# Altium schematic sheet Sheet1.SchDoc: ARDUINO BASED DEVELOPMENT BOARD
size A4; Author: PRATEEK PANDEY; DrawnBy: PRATEEK PANDEY; Engineer: PRATEEK PANDEY; SheetNumber: 1; SheetTotal: 2
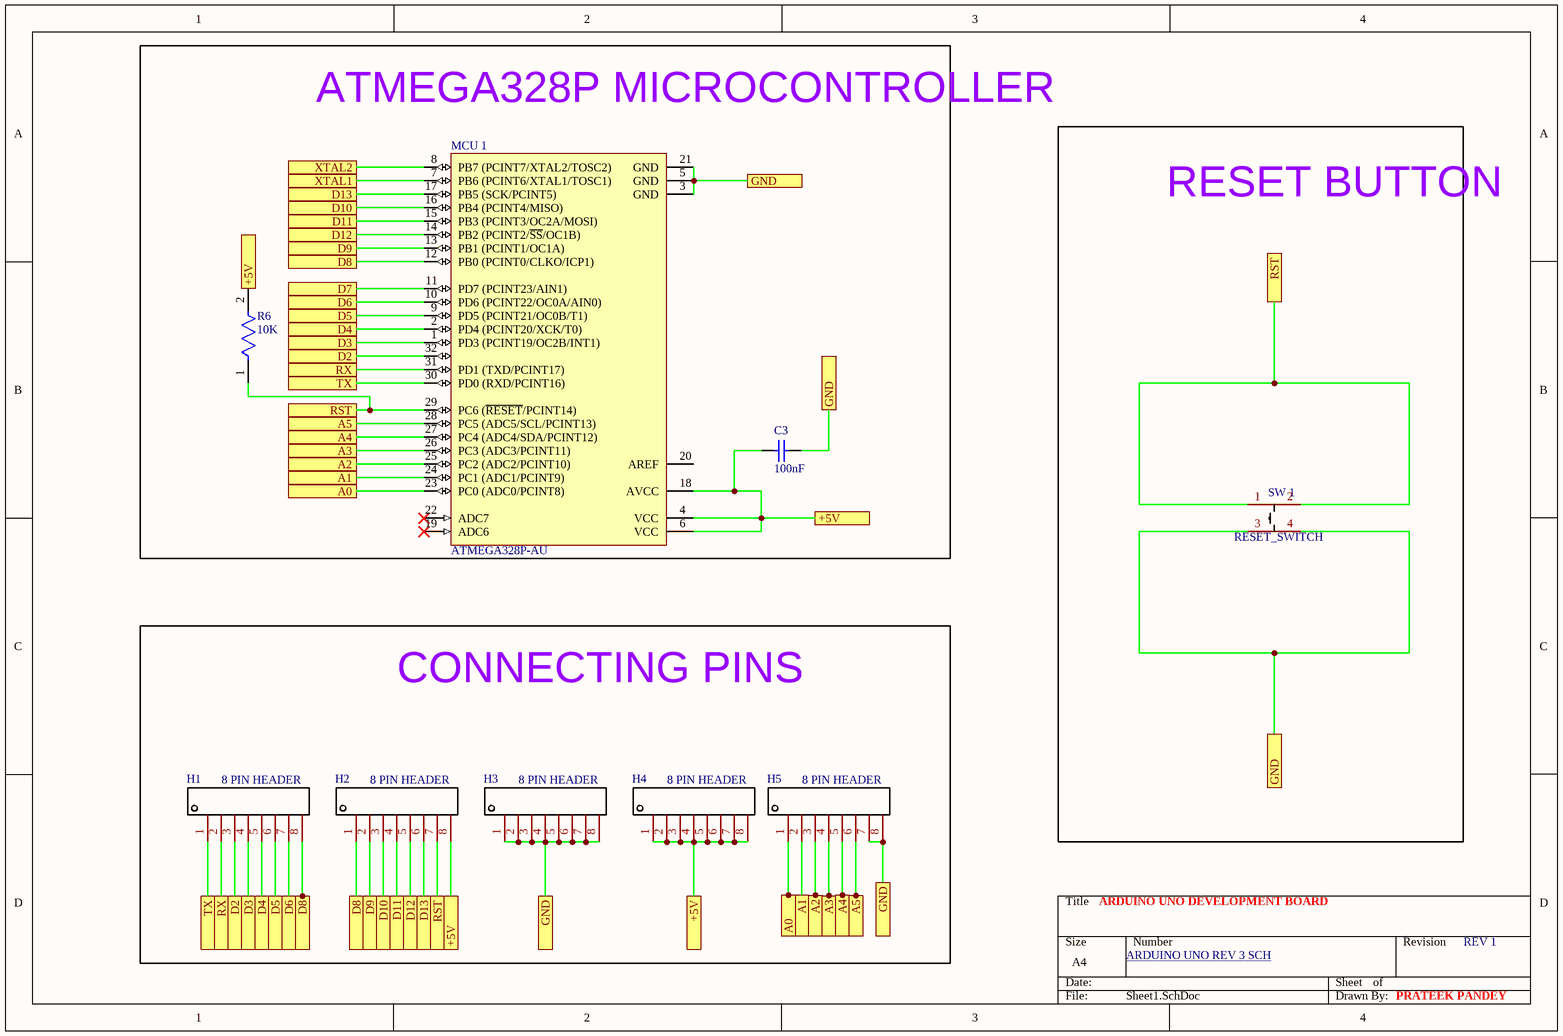
[diagram p0: Sheet1.SchDoc]

## Parts
C3  100nF  [KEMT-1206-2_M]
H1  8 PIN HEADER  [PCBComponent_1]
H2  8 PIN HEADER  [PCBComponent_1]
H3  8 PIN HEADER  [PCBComponent_1]
H4  8 PIN HEADER  [PCBComponent_1]
H5  8 PIN HEADER  [PCBComponent_1]
MCU_1  ATMEGA328P-AU  [32A_M]
R6  10K  [FP-CR1206-IPC_B]
SW_1  RESET_SWITCH  [PCBComponent_1]

## Blocks framed on the sheet
ATMEGA328P MICROCONTROLLER: C3 MCU_1 R6
RESET BUTTON: SW_1
CONNECTING PINS: H1-H5

## Ports
+5V (see Sheet1[1B], Sheet1[2D], Sheet1[3C], Sheet2[3A], Sheet2[4A], Sheet2[4B], Sheet2[4C]), +5V (see Sheet1[1B], Sheet1[2D], Sheet2[3A], Sheet2[4A], Sheet2[4B], Sheet2[4C]), +5V (see Sheet1[2D], Sheet1[3C], Sheet2[3A], Sheet2[4A], Sheet2[4B], Sheet2[4C]), A0 (see Sheet1[1B]), A0 (see Sheet1[3D]), A1 (see Sheet1[1B]), A1 (see Sheet1[3D]), A2 (see Sheet1[1B]), A2 (see Sheet1[3D]), A3 (see Sheet1[1B]), A3 (see Sheet1[3D]), A4 (see Sheet1[1B]), A4 (see Sheet1[3D]), A5 (see Sheet1[1B]), A5 (see Sheet1[3D]), D2 (see Sheet1[1B]), D2 (see Sheet1[1D]), D3 (see Sheet1[1B]), D3 (see Sheet1[1D]), D4 (see Sheet1[1B]), D4 (see Sheet1[1D]), D5 (see Sheet1[1B]), D5 (see Sheet1[1D]), D6 (see Sheet1[1B]), D6 (see Sheet1[1D]), D7 (see Sheet1[1B]), D7 (see Sheet1[1D]), D8 (see Sheet1[1B], Sheet1[1D]), D8 (see Sheet1[1D]), D9 (see Sheet1[1A]), D9 (see Sheet1[1D]), D10 (see Sheet1[1A]), D10 (see Sheet1[1D]), D11 (see Sheet1[1A]), D11 (see Sheet1[2D]), D12 (see Sheet1[1A]), D12 (see Sheet1[2D]), D13 (see Sheet1[1A]), D13 (see Sheet1[2D]), GND (see Sheet1[2A], Sheet1[2D], Sheet1[3B], Sheet1[3D], Sheet2[1A], Sheet2[1D], Sheet2[3A], Sheet2[3B], Sheet2[4D]), GND (see Sheet1[2A], Sheet1[2D], Sheet1[3B], Sheet1[4D], Sheet2[1A], Sheet2[1D], Sheet2[3A], Sheet2[3B], Sheet2[4D]), GND (see Sheet1[2A], Sheet1[2D], Sheet1[3D], Sheet1[4D], Sheet2[1A], Sheet2[1D], Sheet2[3A], Sheet2[3B], Sheet2[4D]), GND (see Sheet1[2A], Sheet1[3B], Sheet1[3D], Sheet1[4D], Sheet2[1A], Sheet2[1D], Sheet2[3A], Sheet2[3B], Sheet2[4D]), GND (see Sheet1[2D], Sheet1[3B], Sheet1[3D], Sheet1[4D], Sheet2[1A], Sheet2[1D], Sheet2[3A], Sheet2[3B], Sheet2[4D]), RST (see Sheet1[1B], Sheet1[2D], Sheet2[3A]), RST (see Sheet1[1B], Sheet1[4B], Sheet2[3A]), RST (see Sheet1[2D], Sheet1[4B], Sheet2[3A]), RX (see Sheet1[1B], Sheet2[2A], Sheet2[4C]), RX (see Sheet1[1D], Sheet2[2A], Sheet2[4C]), TX (see Sheet1[1B], Sheet2[2A], Sheet2[4C]), TX (see Sheet1[1D], Sheet2[2A], Sheet2[4C]), XTAL1 (see Sheet2[1C]), XTAL2 (see Sheet2[2C])

## Nets
+5V: C3.2 H2.8 H4.1 H4.2 H4.3 H4.4 H4.5 H4.6 H4.7 H4.8 MCU_1.4(VCC) MCU_1.6(VCC) MCU_1.18(AVCC) R6.2 ; port +5V
A0: H5.1 MCU_1.23(PC0_(ADC0/PCINT8)) ; port A0
A1: H5.2 MCU_1.24(PC1_(ADC1/PCINT9)) ; port A1
A2: H5.3 MCU_1.25(PC2_(ADC2/PCINT10)) ; port A2
A3: H5.4 MCU_1.26(PC3_(ADC3/PCINT11)) ; port A3
A4: H5.5 MCU_1.27(PC4_(ADC4/SDA/PCINT12)) ; port A4
A5: H5.6 MCU_1.28(PC5_(ADC5/SCL/PCINT13)) ; port A5
D2: H1.3 MCU_1.32(PD2_(INT0/PCINT18)) ; port D2
D3: H1.4 MCU_1.1(PD3_(PCINT19/OC2B/INT1)) ; port D3
D4: H1.5 MCU_1.2(PD4_(PCINT20/XCK/T0)) ; port D4
D5: H1.6 MCU_1.9(PD5_(PCINT21/OC0B/T1)) ; port D5
D6: H1.7 MCU_1.10(PD6_(PCINT22/OC0A/AIN0)) ; port D6
D7: H1.8 H2.1 MCU_1.11(PD7_(PCINT23/AIN1)) MCU_1.12(PB0_(PCINT0/CLKO/ICP1)) ; port D7, port D8
D9: H2.2 MCU_1.13(PB1_(PCINT1/OC1A)) ; port D9
D10: H2.3 MCU_1.16(PB4_(PCINT4/MISO)) ; port D10
D11: H2.4 MCU_1.15(PB3_(PCINT3/OC2A/MOSI)) ; port D11
D12: H2.5 MCU_1.14(PB2_(PCINT2/~{SS}/OC1B)) ; port D12
D13: H2.6 MCU_1.17(PB5_(SCK/PCINT5)) ; port D13
GND: C3.1 H3.1 H3.2 H3.3 H3.4 H3.5 H3.6 H3.7 H3.8 H5.7 H5.8 MCU_1.3(GND) MCU_1.5(GND) MCU_1.21(GND) SW_1.3 SW_1.4 ; port GND
RST: H2.7 MCU_1.29(PC6_(~{RESET}/PCINT14)) R6.1 SW_1.1 SW_1.2 ; port RST
RX: H1.2 MCU_1.31(PD1_(TXD/PCINT17)) ; port RX
TX: H1.1 MCU_1.30(PD0_(RXD/PCINT16)) ; port TX
XTAL1: MCU_1.7(PB6_(PCINT6/XTAL1/TOSC1)) ; port XTAL1
XTAL2: MCU_1.8(PB7_(PCINT7/XTAL2/TOSC2)) ; port XTAL2

Not connected (* = marked no-connect by the designer): MCU_1 19(ADC6)* 20(AREF) 22(ADC7)*

## Notes on the sheet
- ARDUINO UNO DEVELOPMENT BOARD
- ARDUINO UNO REV 3 SCH <https://docs.arduino.cc/resources/schematics/A000066-schematics.pdf>
- REV 1
- PRATEEK PANDEY

## Library data of the parts
C3 = CMP-1037-04202-2: CAP, Ceramic, 0.1 uF, +/- 10%, 50 V, -55 to 125 degC, 1206 (3216 Metric), RoHS, Tape and Reel; Manufacturer: Kemet; Voltage Rating: 50V; Capacitance: 0.1µF; Product Range: KEMET-CSeries; SVHC: ToBeAdvised; Dielectric Characteristic: X7R; Capacitor Case Style: 1206[3216Metric]; Package Reference: 1206-2; Package Description: 2-Leads SMD, Body 3.2 x 1.6 mm; Packaging: Tape&Reel; Operating Temperature Max: 125degC; Capacitance Tolerance: ±10%; Datasheet URL: https://datasheet.ciiva.com/6125/1725438-6125494.pdf; Manufacturer URL: http://www.kemet.com/; Operating Temperature Min: -55degC; Datasheet Version: Jul-13
MCU_1 = CMP-0095-00269-2: 8-bit AVR Microcontroller, 32KB Flash, 1KB EEPROM, 2KB SRAM, 32-pin TQFP, Industrial Grade (-40°C to 85°C); PackageDescription: 32-Lead, 7x7x1.0 mm Body, 0.8mm Lead Pitch, Thin Profile Plastic Quad Flat Package (TQFP); DatasheetVersion: revD, May-2011; RevisionNote: DatasheetVersion & PackageVersion updated. URLs added.; ComponentLink1URL: http://www.atmel.com/; ComponentLink2Description: ATmega48A/48PA/88A/88PA/168A/168PA/328/328P Datasheet; Code_JEDEC: MS-026-ABA; ComponentLink1Description: Manufacturer URL; PackageReference: 32A; ComponentLink3Description: ATmega48A/48PA/88A/88PA/168A/168PA/328/328P Summary; ComponentLink2URL: http://www.atmel.com/dyn/resources/prod_documents/doc8271.pdf; PackageVersion: revC, Oct-2010; ComponentLink3URL: http://www.atmel.com/dyn/resources/prod_documents/8271S.pdf
R6 = CMP-07231-005593-1: Thick Film Chip Resistors 1206 10kΩ 0.25W 5% 200ppm/°C; Voltage Rating: 200V; Resistance: 10kR; Max Power Dissipation: 250mW; Temperature Coefficient: 200ppm/°C; Height: 0.6mm; Case Code (Imperial): 1206; REACH SVHC: No SVHC; Depth: 1.6mm; Mount: Surface Mount; Termination: SMD/SMT; Case/Package: 1206; Min Operating Temperature: -55°C; Features: Moisture Resistant; Number of Pins: 2; Length: 3.2mm; Military Standard: Not; Radiation Hardening: No; Max Operating Temperature: 155°C; Power Rating: 250mW; Case Code (Metric): 3216; Package Quantity: 1; Composition: Thick Film; Tolerance: 5%; Voltage Rating (DC): 200V; Contact Plating: Tin; Thickness: 610um; Number of Terminations: 2; Packaging: Tape and Reel; Width: 1.6mm
SW_1 = Component_1